# EAGLE design Vumetro-v1 (EAGLE 6.2)
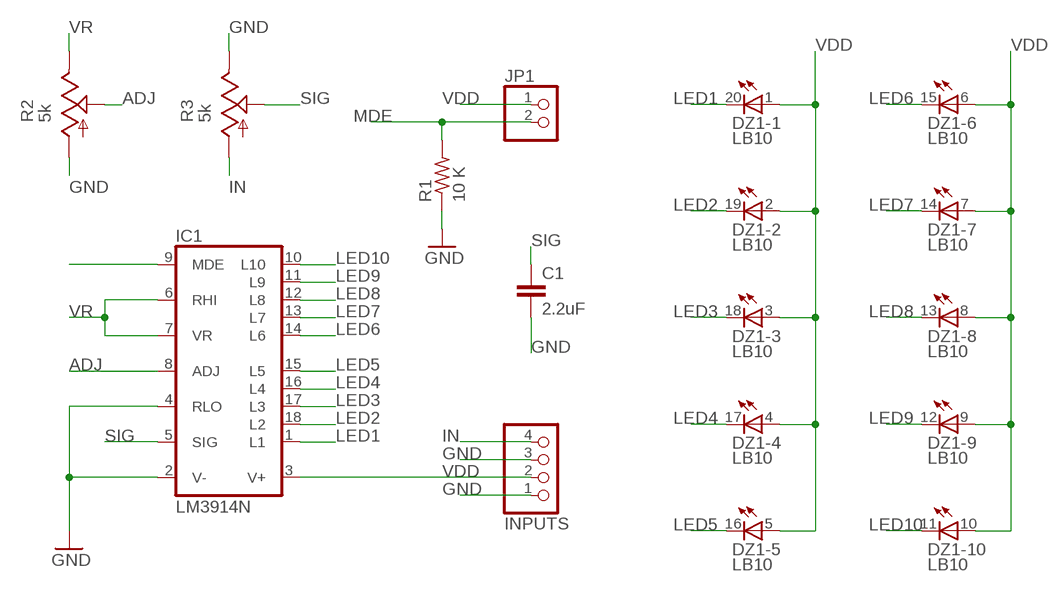
[diagram p0: schematic, sheet 1]

## Parts
C1  2.2uF  C2.5/6  [C2.5-6]
DZ1  LB10  [LB10]
IC1  LM3914N  [DIL18]
INPUTS  PINHD-1X4  [1X04]
JP1  PINHD-1X2  [1X02]
R1  10 K  R-US_0204/5  [0204/5]
R2  5k  TRIM_US-PT10  [PT-10]
R3  5k  TRIM_US-PT10  [PT-10]

## Nets
ADJ: IC1.8(ADJ) R2.S
GND: C1.2 IC1.2(V-) IC1.4(RLO) INPUTS.1 INPUTS.3 R1.1 R2.A R3.E
IN: INPUTS.4 R3.A
LED1: DZ1.20(-1:C) IC1.1(L1)
LED2: DZ1.19(-2:C) IC1.18(L2)
LED3: DZ1.18(-3:C) IC1.17(L3)
LED4: DZ1.17(-4:C) IC1.16(L4)
LED5: DZ1.16(-5:C) IC1.15(L5)
LED6: DZ1.15(-6:C) IC1.14(L6)
LED7: DZ1.14(-7:C) IC1.13(L7)
LED8: DZ1.13(-8:C) IC1.12(L8)
LED9: DZ1.12(-9:C) IC1.11(L9)
LED10: DZ1.11(-10:C) IC1.10(L10)
MDE: IC1.9(MDE) JP1.2 R1.2
SIG: C1.1 IC1.5(SIG) R3.S
VDD: DZ1.1(-1:A) DZ1.2(-2:A) DZ1.3(-3:A) DZ1.4(-4:A) DZ1.5(-5:A) DZ1.6(-6:A) DZ1.7(-7:A) DZ1.8(-8:A) DZ1.9(-9:A) DZ1.10(-10:A) IC1.3(V+) INPUTS.2 JP1.1
VR: IC1.6(RHI) IC1.7(VR) R2.E

## Library data of the parts
C1 = capacitor-wima:C: CAPACITOR naming: grid - package width
DZ1 = led:LB10: LED BLOCK 10-LED bar graph, DIL, Matos
IC1 = linear:LM3914N: LED DRIVER senses analog voltage levels and drives 10 LEDs
INPUTS = pinhead:PINHD-1X4: PIN HEADER
JP1 = pinhead:PINHD-1X2: PIN HEADER
R1 = resistor:R-US_: RESISTOR, American symbol
R2 R3 = pot:TRIM_US-: POTENTIOMETER

## Board
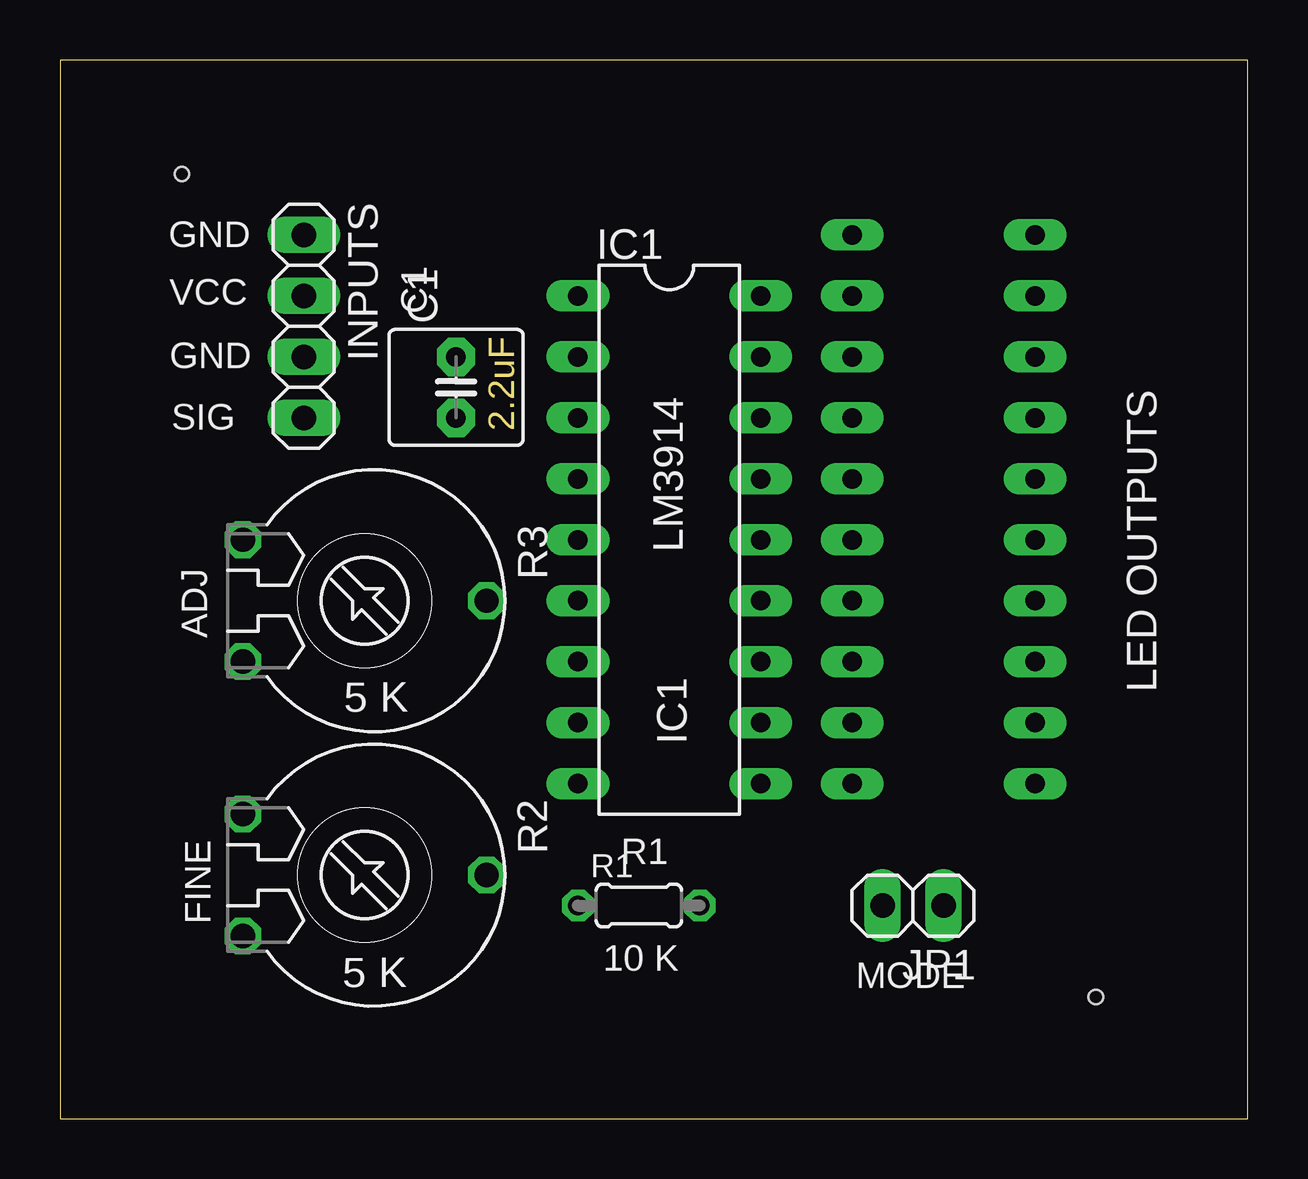
[diagram p1: board, top side]
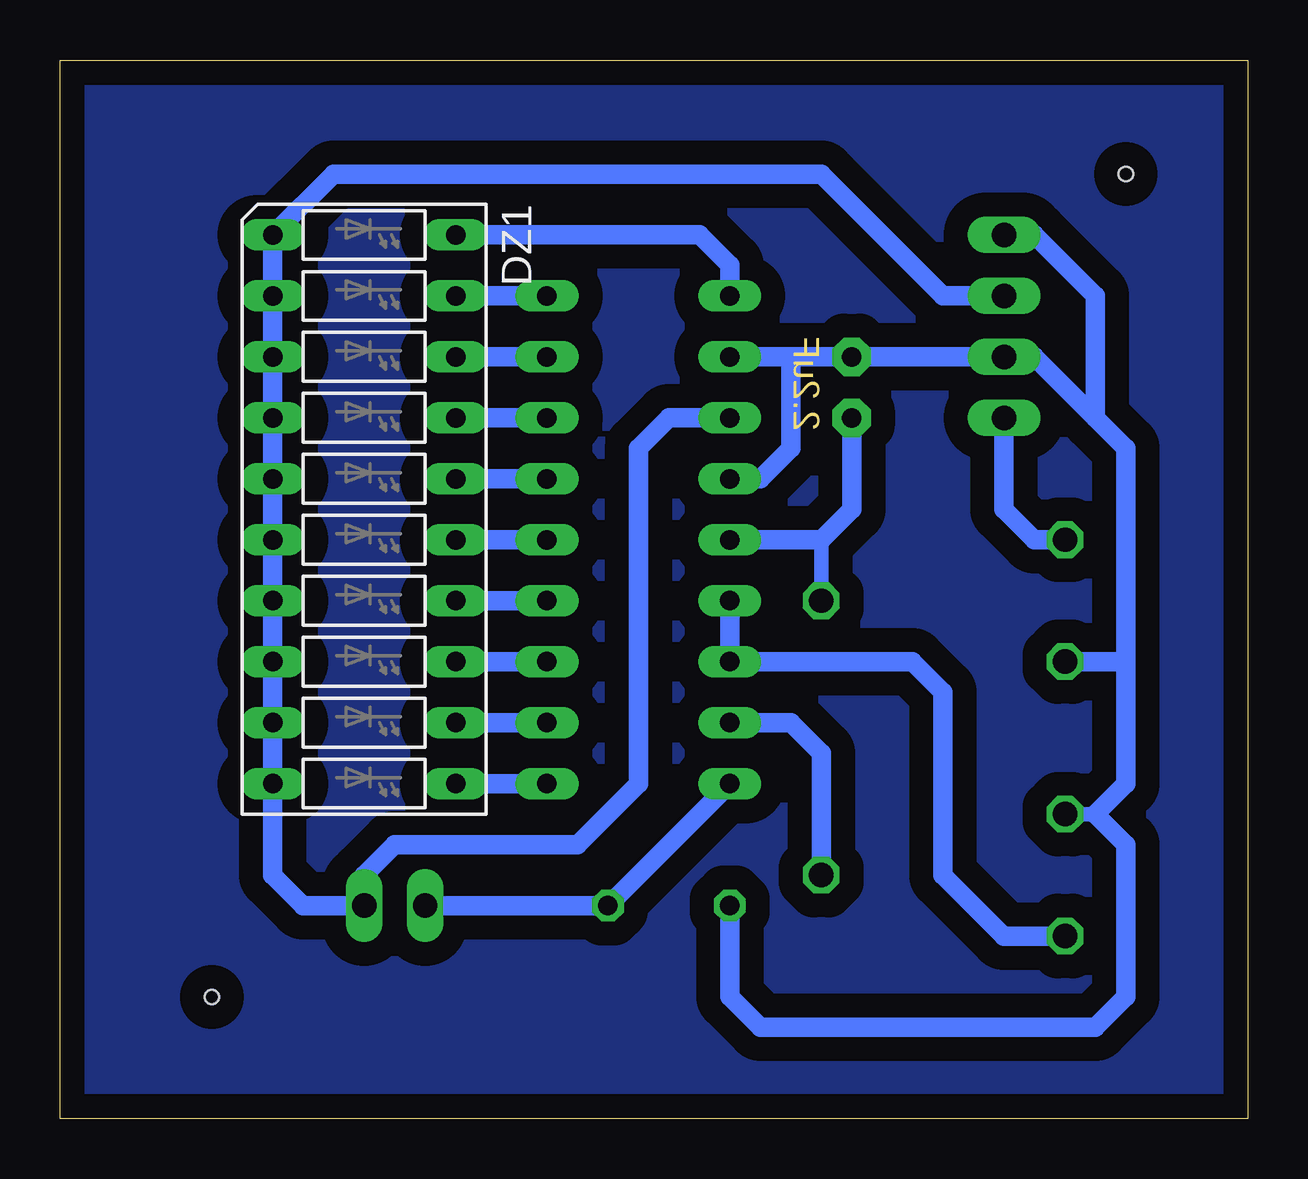
[diagram p2: board, bottom side, seen from below]

Size 49.51 x 44.12 mm. Coordinates in mm from the lower left corner, seen from the top.
Outline: 0,0 49.51,0 49.51,44.12 0,44.12 0,0
Copper layers (1*16): Top 0.035mm / dielectric 1.5mm / Bottom 0.035mm
Design rules: minimum track width 10mil, minimum drill 24mil, track to track 8mil, track to pad 8mil, pad to pad 8mil, via to via 8mil, smd to smd 8mil, copper to edge 40mil, drill to drill 8mil, minimum pad ring 10mil, minimum via ring 8mil, stop-mask expansion 4mil, vias tented up to drill 0mil, thermal gap 10mil
Holes 0.6 mm at 43.18,5.08 5.08,39.37

### Footprints (pad centres in the part's own frame; a part is rotated, then mirrored left to right if it is on the bottom)
C2.5-6 = drill 0.813 pad 1.6 octagon: 1 -1.27,0; 2 1.27,0
LB10 = drill 0.813 long: 1 -11.43,-3.81; 2 -8.89,-3.81; 3 -6.35,-3.81; 4 -3.81,-3.81; 5 -1.27,-3.81; 6 1.27,-3.81; 7 3.81,-3.81; 8 6.35,-3.81; 9 8.89,-3.81; 10 11.43,-3.81; 11 11.43,3.81; 12 8.89,3.81; 13 6.35,3.81; 14 3.81,3.81; 15 1.27,3.81; 16 -1.27,3.81; 17 -3.81,3.81; 18 -6.35,3.81; 19 -8.89,3.81; 20 -11.43,3.81
DIL18 = drill 0.813 long: 1 -10.16,-3.81; 2 -7.62,-3.81; 3 -5.08,-3.81; 4 -2.54,-3.81; 5 0,-3.81; 6 2.54,-3.81; 7 5.08,-3.81; 8 7.62,-3.81; 9 10.16,-3.81; 10 10.16,3.81; 11 7.62,3.81; 12 5.08,3.81; 13 2.54,3.81; 14 0,3.81; 15 -2.54,3.81; 16 -5.08,3.81; 17 -7.62,3.81; 18 -10.16,3.81
1X04 = drill 1.016 long: 1 -3.81,0; 2 -1.27,0; 3 1.27,0; 4 3.81,0
1X02 = drill 1.016 long: 1 -1.27,0; 2 1.27,0
0204/5 = drill 0.813 octagon: 1 -2.54,0; 2 2.54,0
PT-10 = drill 1.016 octagon: A -2.54,-5.08; E 2.54,-5.08; S 0,5.08

### Placement (x,y rotation side)
C1  16.51,30.48 90 top
DZ1  36.83,25.4 270 bottom
IC1  25.4,24.13 270 top
INPUTS  10.16,33.02 270 top
JP1  35.56,8.89 180 top
R1  24.13,8.89 0 top
R2  12.7,10.16 270 top
R3  12.7,21.59 270 top

### Tracks (layer width: path | path; a pad name or v marks a point on that pad's centre or on a via)
ADJ
  Bottom 0.813: R2.S 17.78,15.24 19.05,16.51 IC1.8
GND
  Bottom 0.61: 6.35,12.7 R2.A
  Bottom 0.813: 19.05,31.75 C1.2 INPUTS.3 8.89,31.75 6.35,29.21 | 19.05,31.75 IC1.2 | IC1.4 20.32,26.67 19.05,27.94 19.05,31.75 | INPUTS.1 8.89,36.83 6.35,34.29 6.35,29.21 | 6.35,29.21 5.08,27.94 5.08,19.05 | 5.08,19.05 5.08,13.97 6.35,12.7 5.08,11.43 5.08,5.08 6.35,3.81 20.32,3.81 21.59,5.08 R1.1 | R3.E 5.08,19.05
IN
  Bottom 0.813: R3.A 8.89,24.13 10.16,25.4 INPUTS.4
LED1
  Bottom 0.813: IC1.1 21.59,35.56 22.86,36.83 DZ1.20
LED2
  Bottom 0.813: IC1.18 DZ1.19
LED3
  Bottom 0.813: IC1.17 DZ1.18
LED4
  Bottom 0.813: IC1.16 DZ1.17
LED5
  Bottom 0.813: IC1.15 DZ1.16
LED6
  Bottom 0.813: IC1.14 DZ1.15
LED7
  Bottom 0.813: IC1.13 DZ1.14
LED8
  Bottom 0.813: IC1.12 DZ1.13
LED9
  Bottom 0.813: IC1.11 DZ1.12
LED10
  Bottom 0.813: IC1.10 DZ1.11
MDE
  Bottom 0.813: JP1.2 R1.2 IC1.9
N$1
  pour Bottom (isolate 1): 0,44.45 49.53,44.45 49.53,0 0,0
SIG
  Bottom 0.61: R3.S 17.78,24.13
  Bottom 0.813: C1.1 16.51,25.4 17.78,24.13 IC1.5
VDD
  Bottom 0.813: INPUTS.2 12.7,34.29 17.78,39.37 38.1,39.37 DZ1.1 DZ1.2 DZ1.3 DZ1.4 DZ1.5 DZ1.6 DZ1.7 DZ1.8 DZ1.9 DZ1.10 40.64,10.16 39.37,8.89 JP1.1 36.83,10.16 35.56,11.43 27.94,11.43 25.4,13.97 25.4,27.94 24.13,29.21 IC1.3
VR
  Bottom 0.813: IC1.6 IC1.7 13.97,19.05 12.7,17.78 12.7,10.16 10.16,7.62 R2.E

### Text on the board
Dimension: 2.2uF
tPlace: GND | VCC | C1 | GND | SIG | ADJ | LM3914 | 5 K | LED OUTPUTS | IC1 | FINE | R1 | 5 K | 10 K | MODE